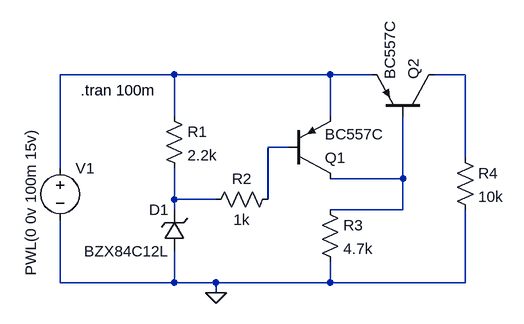
[diagram p0: schematic PNPCircuit.asc]
PNPCircuit.asc, the LTspice schematic file:
Version 4
SHEET 1 880 680
WIRE 80 -16 -96 -16
WIRE 320 -16 80 -16
WIRE 384 -16 320 -16
WIRE 528 -16 480 -16
WIRE 80 48 80 -16
WIRE 320 48 320 -16
WIRE 256 96 224 96
WIRE 528 112 528 -16
WIRE -96 128 -96 -16
WIRE 432 144 432 48
WIRE 432 144 320 144
WIRE 80 176 80 128
WIRE 144 176 80 176
WIRE 224 176 224 96
WIRE 80 192 80 176
WIRE 432 192 432 144
WIRE 432 192 320 192
WIRE -96 304 -96 208
WIRE 80 304 80 256
WIRE 80 304 -96 304
WIRE 144 304 80 304
WIRE 320 304 320 272
WIRE 320 304 144 304
WIRE 528 304 528 192
WIRE 528 304 320 304
WIRE 144 320 144 304
FLAG 144 320 0
SYMBOL voltage -96 112 R0
WINDOW 3 -45 182 VLeft 2
WINDOW 123 0 0 Left 0
WINDOW 39 0 0 Left 0
SYMATTR InstName V1
SYMATTR Value PWL(0 0v 100m 15v)
SYMBOL res 64 32 R0
SYMATTR InstName R1
SYMATTR Value 2.2k
SYMBOL res 240 160 R90
WINDOW 0 0 56 VBottom 2
WINDOW 3 32 56 VTop 2
SYMATTR InstName R2
SYMATTR Value 1k
SYMBOL res 304 176 R0
SYMATTR InstName R3
SYMATTR Value 4.7k
SYMBOL res 512 96 R0
SYMATTR InstName R4
SYMATTR Value 10k
SYMBOL pnp 256 144 M180
SYMATTR InstName Q1
SYMATTR Value BC557C
SYMBOL pnp 480 48 M270
SYMATTR InstName Q2
SYMATTR Value BC557C
SYMBOL zener 96 256 R180
WINDOW 0 24 64 Left 2
WINDOW 3 24 0 Left 2
SYMATTR InstName D1
SYMATTR Value BZX84C12L
SYMATTR Description Diode
SYMATTR Type diode
TEXT -64 8 Left 2 !.tran 100m

The netlist it stands for:
* PNPCircuit.asc
V1 N001 0 PWL(0 0v 100m 15v)
R1 N001 N005 2.2k
R2 N003 N005 1k
R3 N004 0 4.7k
R4 N002 0 10k
Q1 N004 N003 N001 0 BC557C
Q2 N002 N004 N001 0 BC557C
D1 0 N005 BZX84C12L
.model D D
.lib standard.dio
.model NPN NPN
.model PNP PNP
.lib standard.bjt
.tran 100m
.backanno
.end